# EAGLE design Pedal Board Power Supply (EAGLE 6.5.0)
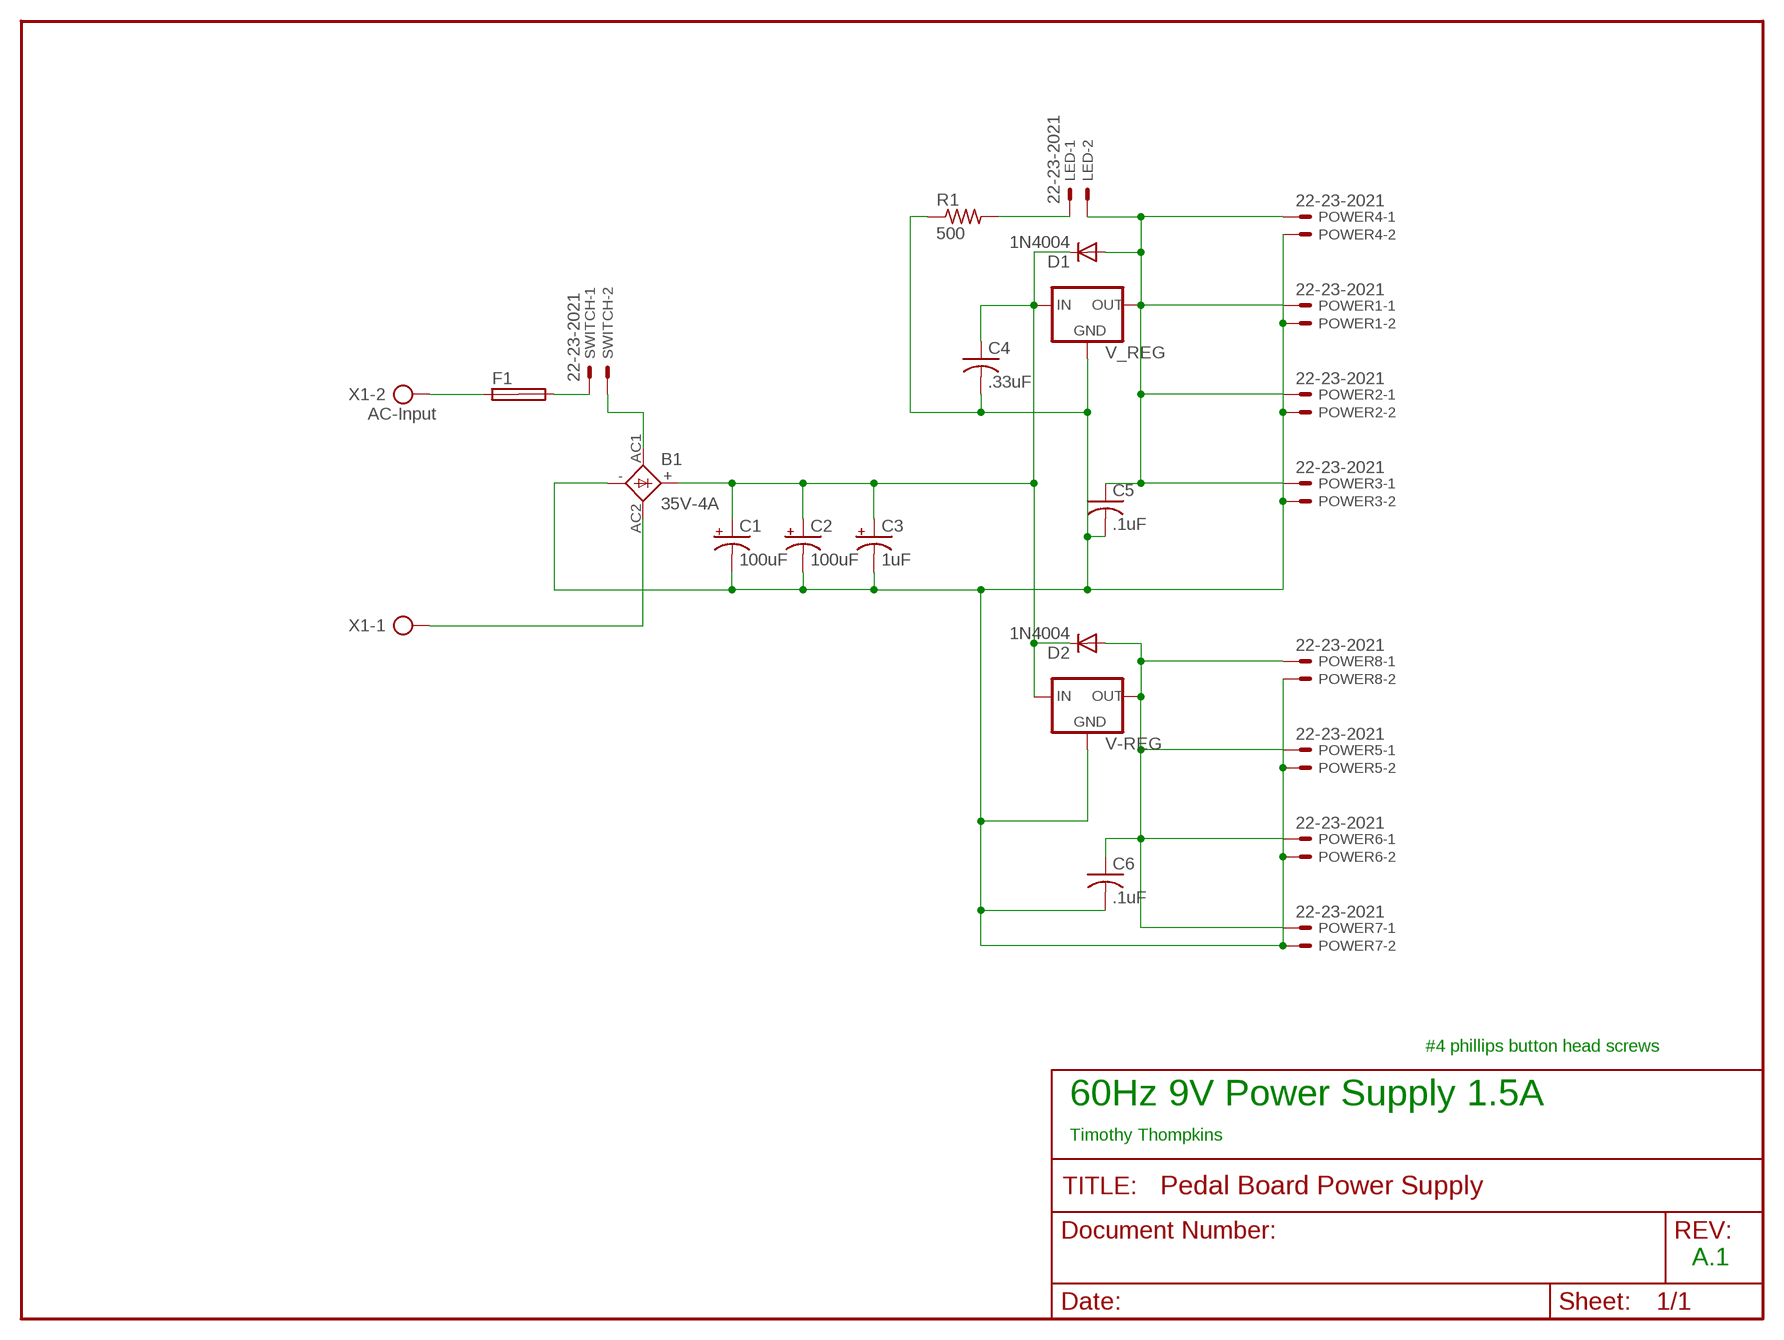
[diagram p0: schematic, sheet 1]

## Parts
B1  35V-4A  GBL005  [GBL]
C1  100uF  CPOL-USE3.5-10  [E3,5-10]
C2  100uF  CPOL-USE3.5-10  [E3,5-10]
C3  1uF  CPOL-USE3.5-10  [E3,5-10]
C4  .33uF  C-US050-025X075  [C050-025X075]
C5  .1uF  C-US050-025X075  [C050-025X075]
C6  .1uF  C-US050-025X075  [C050-025X075]
D1  1N4004  [DO41-10]
D2  1N4004  [DO41-10]
F1  SHK20Q  [SHK20Q]
LED  22-23-2021  [22-23-2021]
POWER1  22-23-2021  [22-23-2021]
POWER2  22-23-2021  [22-23-2021]
POWER3  22-23-2021  [22-23-2021]
POWER4  22-23-2021  [22-23-2021]
POWER5  22-23-2021  [22-23-2021]
POWER6  22-23-2021  [22-23-2021]
POWER7  22-23-2021  [22-23-2021]
POWER8  22-23-2021  [22-23-2021]
R1  500  R-US_0204/7  [0204/7]
SWITCH  22-23-2021  [22-23-2021]
V-REG  V_REG_78XXSINK  [TO220-IGO]
V_REG  V_REG_78XXSINK  [TO220-IGO]
X1  AC-Input  AK500/2  [AK500/2]

## Nets
$N5: B1.AC2 X1.1
GND: B1.- C1.- C2.- C3.- C4.2 C5.2 C6.2 POWER1.2 POWER2.2 POWER3.2 POWER4.2 POWER5.2 POWER6.2 POWER7.2 POWER8.2 R1.1 V-REG.GND V_REG.GND
N$1: F1.1A X1.2
N$3: F1.2A SWITCH.1
N$4: C5.1 D1.A LED.2 POWER1.1 POWER2.1 POWER3.1 POWER4.1 V_REG.OUT
N$5: C6.1 D2.A POWER5.1 POWER6.1 POWER7.1 POWER8.1 V-REG.OUT
N$6: LED.1 R1.2
N$7: B1.AC1 SWITCH.2
V+: B1.+ C1.+ C2.+ C3.+ C4.1 D1.C D2.C V-REG.IN V_REG.IN
Unconnected: F1.1B F1.2B

## Notes on the sheet
- #4 phillips button head screws
- 60Hz 9V Power Supply 1.5A
- Timothy Thompkins
- A.1

## Library data of the parts
B1 = kevin:GBL: DIODE RECTIFIER Glass Passivated Single-Phase Bridge Rectifier GBL005 thru GBL10
C1-C3 = resistor:CPOL-US: POLARIZED CAPACITOR, American symbol
C4-C6 = resistor:C-US: CAPACITOR, American symbol
D1 D2 = diode:1N4004: DIODE general purpose rectifier, 1 A
F1 = fuse:SHK20Q: FUSE HOLDER 5 x 20 mm, SH contact, E1207 Buerklin 64G6061; OC_FARNELL: unknown; OC_NEWARK: unknown
LED POWER1-POWER8 SWITCH = con-molex:22-23-2021: .100" (2.54mm) Center Header - 2 Pin
R1 = adafruit:R-US_: RESISTOR, American symbol
V-REG V_REG = SparkFun:V_REG_78XX: Voltage Regulator Standard 7805 5V regulator. IGO (Input Ground Output). Spark Fun Electronics SKU : COM-00107
X1 = con-ptr500:AK500/2: CONNECTOR; OC_FARNELL: unknown; OC_NEWARK: unknown

## Net classes
1 AC: width 2.032 mm, clearance 1.27 mm
2 DC: width 2.032 mm, clearance 1.016 mm

## Board
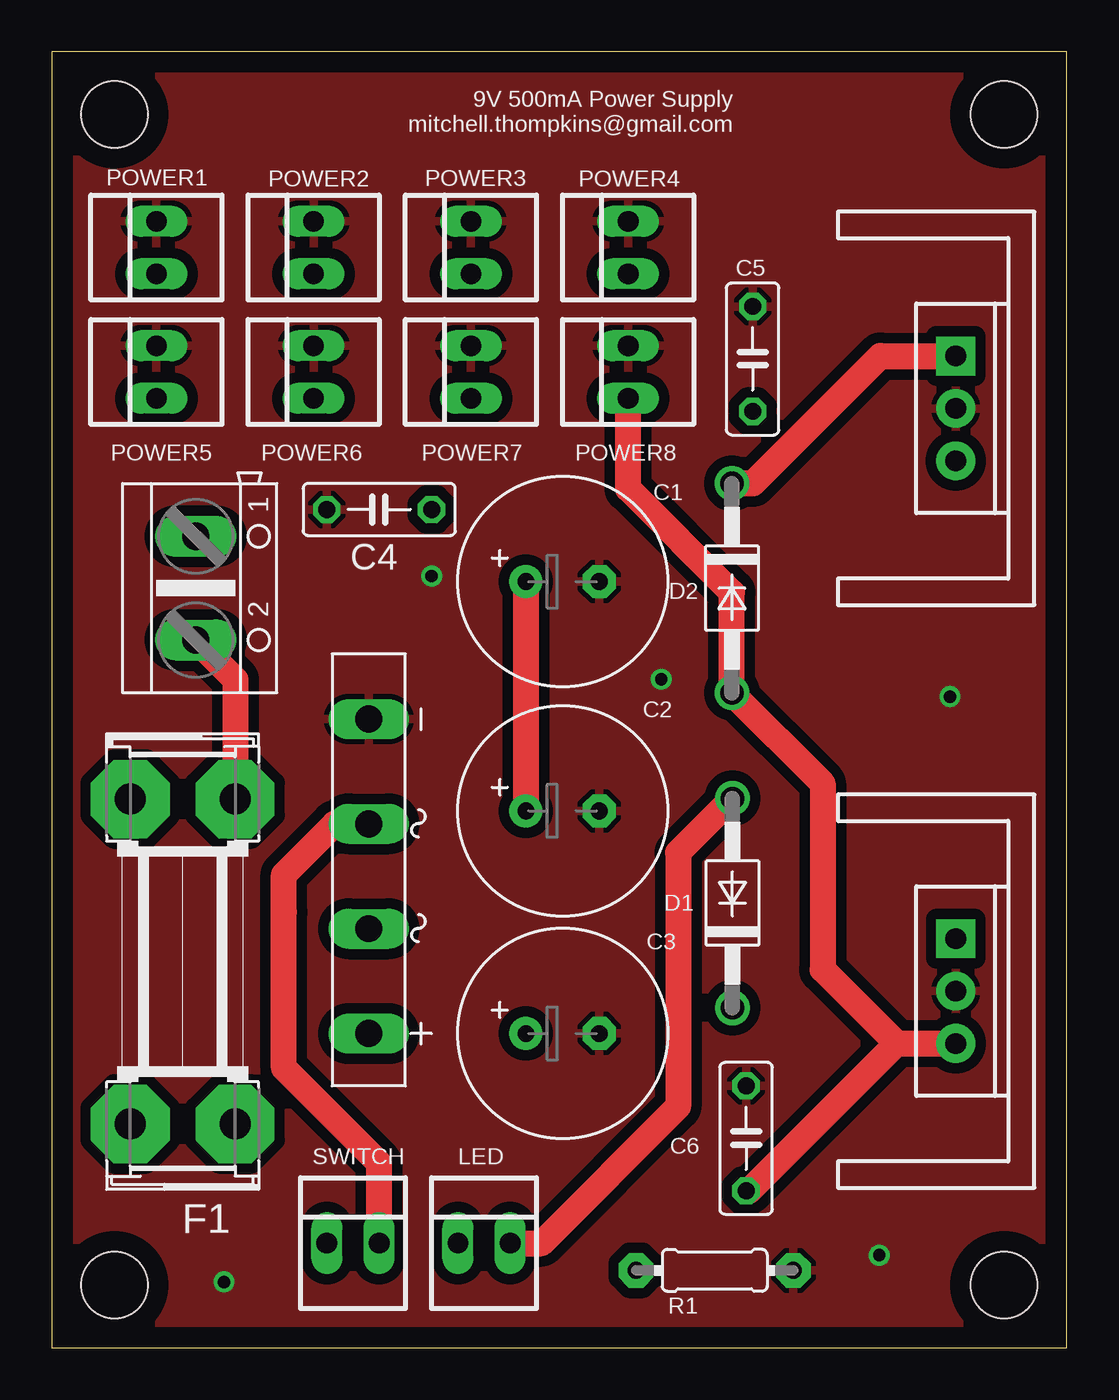
[diagram p1: board, top side]
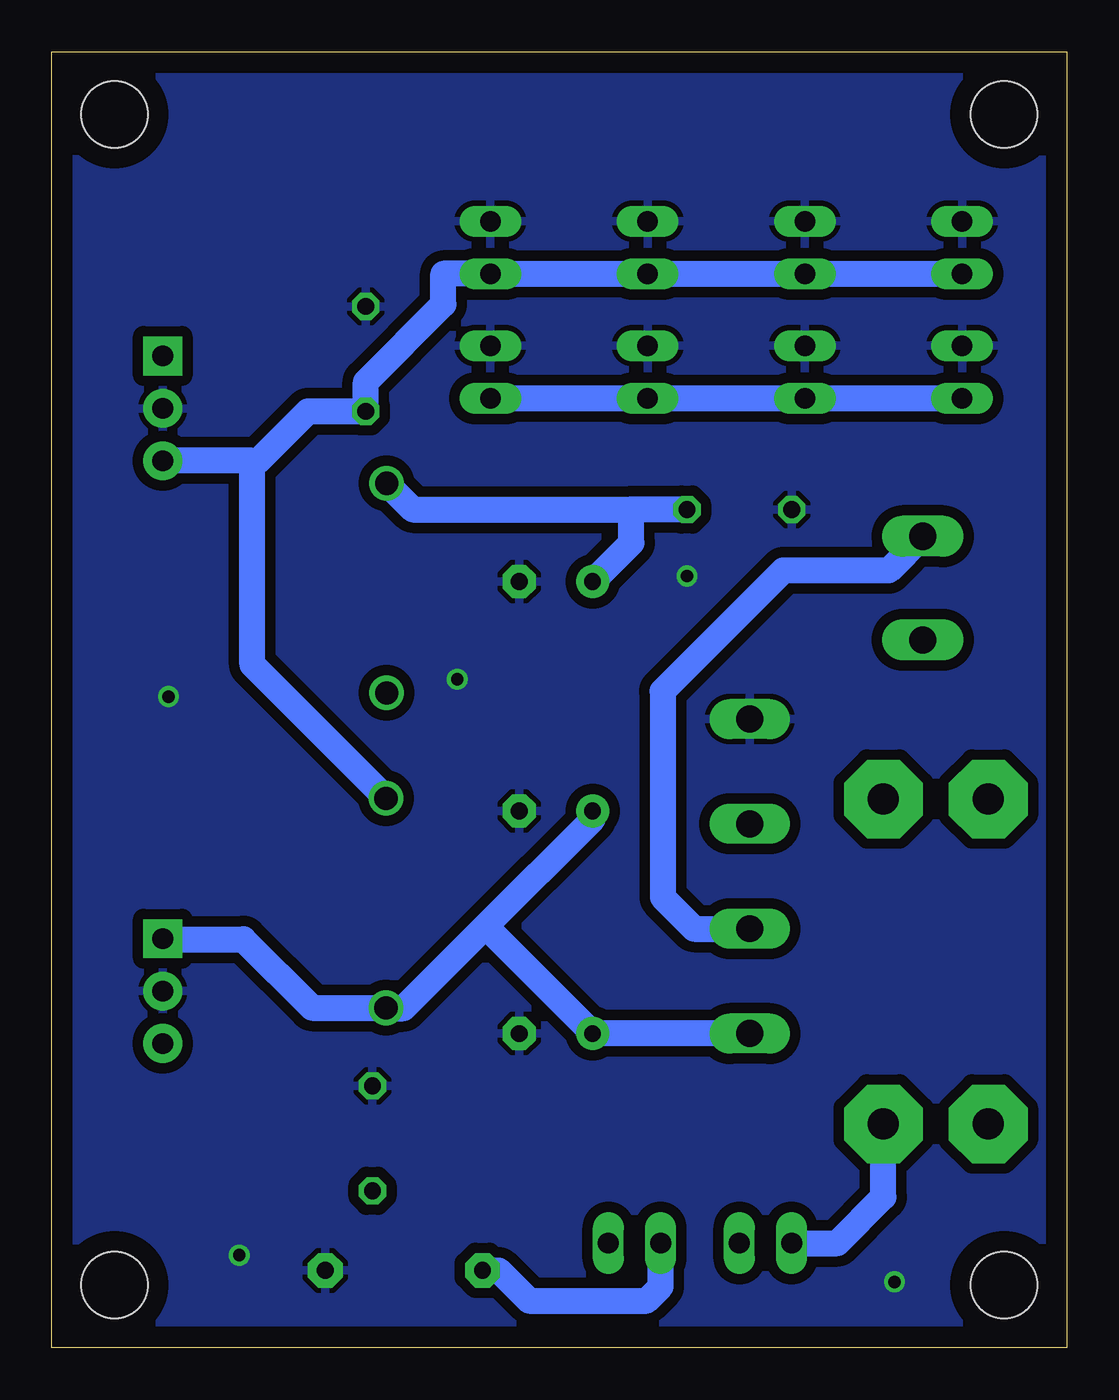
[diagram p2: board, bottom side, seen from below]

Size 49.2 x 62.84 mm. Coordinates in mm from the lower left corner, seen from the top.
Outline: 0,0 49.2,0 49.2,62.84 0,62.84 0,0
Copper layers (1*16): Top 0.035mm / dielectric 1.5mm / Bottom 0.035mm
Design rules "default *": minimum track width 5mil, minimum drill 13mil, track to track 20mil, track to pad 18mil, pad to pad 12mil, via to via 12mil, smd to smd 8mil, copper to edge 40mil, drill to drill 8mil, minimum pad ring 10mil, minimum via ring 8mil, stop-mask expansion 4mil, vias tented up to drill 0mil, thermal gap 10mil
Holes 3.2 mm at 3.05,3.05 46.15,3.05 3.05,59.79 46.15,59.79

### Footprints (pad centres in the part's own frame; a part is rotated, then mirrored left to right if it is on the bottom)
GBL = drill 1.3 pad 1.676 long: + 2.54,1.778; - 17.78,1.778; AC1 12.7,1.778; AC2 7.62,1.778
E3,5-10 = drill 0.813 pad 1.6: + -1.778,0 | drill 0.813 pad 1.6 octagon: - 1.778,0
C050-025X075 = drill 0.813 octagon: 1 -2.54,0; 2 2.54,0
DO41-10 = drill 1.118: A 5.08,0; C -5.08,0
SHK20Q = drill 1.5 pad 3.81 octagon: 1A -7.874,2.54; 1B -7.874,-2.54; 2A 7.874,2.54; 2B 7.874,-2.54
22-23-2021 = drill 1 long: 1 -1.27,0; 2 1.27,0
0204/7 = drill 0.813 pad 1.676 octagon: 1 -3.81,0; 2 3.81,0
TO220-IGO = drill 1 pad 1.88: GND 0,0; OUT 2.54,0 | drill 1 pad 1.88 square: IN -2.54,0
AK500/2 = drill 1.321 long: 1 -2.515,0; 2 2.515,0

### Placement (x,y rotation side)
B1  17.14,12.7 90 top
C1  24.77,37.15 0 top
C2  24.77,26.04 0 top
C3  24.77,15.24 0 top
C4  15.88,40.64 180 top
C5  33.97,47.94 90 top
C6  33.66,10.16 90 top
D1  32.99,21.56 90 top
D2  32.97,36.83 270 top
F1  6.35,18.73 270 top
LED  20.95,5.08 0 top
POWER1  5.08,53.34 90 top
POWER2  12.7,53.34 90 top
POWER3  20.32,53.34 90 top
POWER4  27.94,53.34 90 top
POWER5  5.08,47.31 90 top
POWER6  12.7,47.31 90 top
POWER7  20.32,47.31 90 top
POWER8  27.94,47.31 90 top
R1  32.13,3.76 180 top
SWITCH  14.61,5.08 0 top
V-REG  43.81,17.3 270 top
V_REG  43.81,45.54 270 top
X1  6.99,36.83 270 top

### Tracks (layer width: path | path; a pad name or v marks a point on that pad's centre or on a via)
$N5
  Bottom 1.27: X1.1 8.64,37.69 13.74,37.69 19.6,31.83 19.58,31.81 19.58,21.84 18.06,20.32 B1.AC2
GND  (via drill 0.6, 0.6 pad 0.69)
  other vias: 18.41,37.41 8.36,3.2 40.11,4.5 43.54,31.57 29.54,32.41
  pour Bottom: 0,0 49.28,0 49.28,62.74 0,62.74
  pour Top: 0,0 49.28,0 49.28,62.74 0,62.74
N$1
  Top 1.27: F1.1A 8.91,26.63 8.91,29.72 8.91,32.38 X1.2
N$3
  Bottom 1.27: SWITCH.1 11.12,5.08 8.89,7.32 F1.2A
N$4
  Top 1.27: LED.2 23.74,5.08 30.36,11.7 30.36,24.01 D1.A
  Bottom 0.813: C5.1 33.98,45.39 | 39.17,43 39.47,43
  Bottom 1.27: C5.1 33.97,46.83 30.21,50.59 30.21,52.07 POWER4.1 POWER3.1 POWER2.1 POWER1.1 | 33.98,45.39 36.78,45.39 39.17,43 | D1.A 39.47,33.12 39.47,43 V_REG.OUT
N$5
  Top 1.27: C6.1 33.81,7.62 40.95,14.76 | 40.95,14.76 V-REG.OUT | 40.95,14.76 37.36,18.34 37.36,27.36 D2.A 32.97,36.63 27.94,41.66 POWER8.1
  Bottom 1.27: POWER5.1 POWER6.1 POWER7.1 POWER8.1
N$6
  Bottom 1.27: R1.2 27.53,3.76 26.06,2.29 20.37,2.29 19.68,2.97 LED.1
N$7
  Top 1.27: SWITCH.2 15.88,8.94 11.25,13.56 11.25,21.13 11.25,22.94 13.72,25.4 B1.AC1
V+
  Top 1.27: C1.+ C2.+ | D2.C 33.98,41.91 40.16,48.08 V_REG.IN
  Bottom 0.813: V-REG.IN 43.79,19.81
  Bottom 1.27: 43.79,19.81 39.9,19.81 36.58,16.48 D1.C 32.97,16.46 32.16,16.46 28.22,20.4 | D2.C 31.7,40.64 21.11,40.64 | C4.1 21.11,40.64 | C1.+ 21.11,39.03 21.11,40.64 | B1.+ C3.+ | C3.+ 22.96,15.21 22.81,15.21 | 28.22,20.4 22.99,25.63 C2.+ | C3.+ 28.14,20.4 28.22,20.4

### Text on the board
tNames: 9V 500mA Power Supply / mitchell.thompkins@gmail.com